# EAGLE schematic ArtNet SMD (EAGLE 5.11)
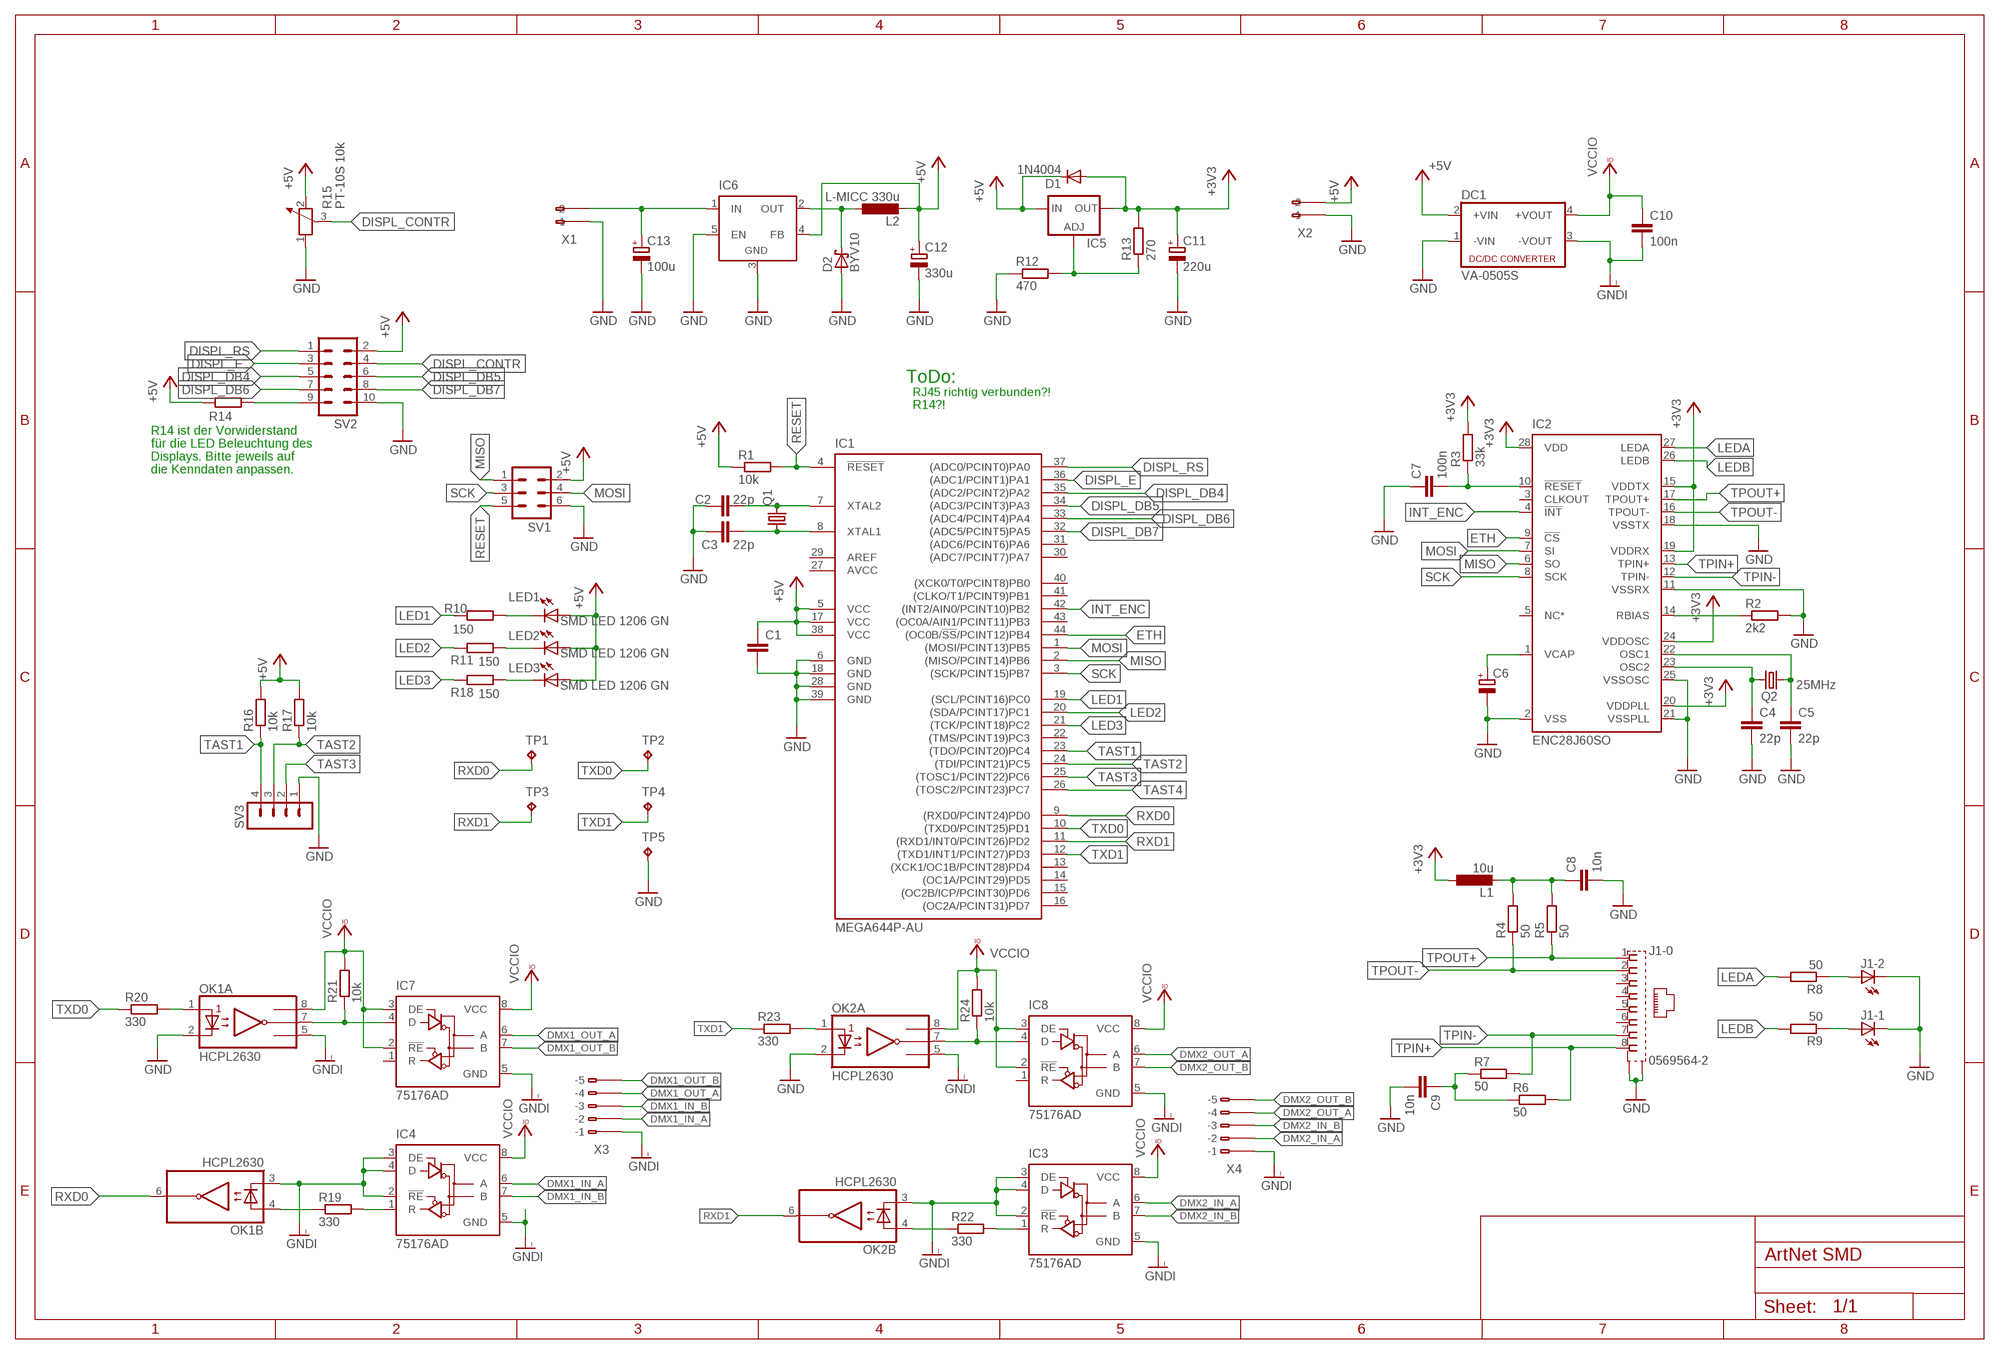
[diagram p0: schematic, sheet 1]

## Parts
C1  C-EUC1206  [C1206]
C2  22p  C-EUC1206  [C1206]
C3  22p  C-EUC1206  [C1206]
C4  22p  C-EUC1206  [C1206]
C5  22p  C-EUC1206  [C1206]
C6  CPOL-EUUD-4X5,8  [UD-4X5,8_NICHICON]
C7  100n  C-EUC1206  [C1206]
C8  10n  C-EUC1206  [C1206]
C9  10n  C-EUC1206  [C1206]
C10  100n  C-EUC1206  [C1206]
C11  220u  CPOL-EUUD-6,3X7,7  [UD-6,3X7,7_NICHICON]
C12  330u  CPOL-EUUD-6,3X7,7  [UD-6,3X7,7_NICHICON]
C13  100u  CPOL-EUUD-5X5,8  [UD-5X5,8_NICHICON]
D1  1N4004  [DO41-10]
D2  BYV10  [DO41-10]
DC1  VA-0505S  [4SIL]
IC1  MEGA644P-AU  MEGA164P/324P/644P-AU  [TQFP44]
IC2  ENC28J60SO  [SO28W]
IC3  75176AD  [D_R-PDSO-G8]
IC4  75176AD  [D_R-PDSO-G8]
IC5  LM317TS  [317TS]
IC6  LM2596TV  [TO220-51]
IC7  75176AD  [D_R-PDSO-G8]
IC8  75176AD  [D_R-PDSO-G8]
J1  0569564-2  [0569564]
L1  10u  L-EULAL02  [LAL02]
L2  L-MICC 330u  L-EU0207/5V  [0207/5V]
LED1  SMD LED 1206 GN  LEDCHIPLED_1206  [CHIPLED_1206]
LED2  SMD LED 1206 GN  LEDCHIPLED_1206  [CHIPLED_1206]
LED3  SMD LED 1206 GN  LEDCHIPLED_1206  [CHIPLED_1206]
OK1  HCPL2630  [DIL08]
OK2  HCPL2630  [DIL08]
Q1  CRYSTALSM49  [SM49]
Q2  25MHz  CRYSTALHC49U-V  [HC49U-V]
R1  10k  R-EU_R1206  [R1206]
R2  2k2  R-EU_R1206  [R1206]
R3  33k  R-EU_R1206  [R1206]
R4  50  R-EU_R1206  [R1206]
R5  50  R-EU_R1206  [R1206]
R6  50  R-EU_R1206  [R1206]
R7  50  R-EU_R1206  [R1206]
R8  50  R-EU_R1206  [R1206]
R9  50  R-EU_R1206  [R1206]
R10  150  R-EU_R1206  [R1206]
R11  150  R-EU_R1206  [R1206]
R12  470  R-EU_R1206  [R1206]
R13  270  R-EU_R1206  [R1206]
R14  R-EU_R1206  [R1206]
R15  PT-10S 10k  POTENTIOMETER_PT-10S  [PT-10S]
R16  10k  R-EU_R1206  [R1206]
R17  10k  R-EU_R1206  [R1206]
R18  150  R-EU_R1206  [R1206]
R19  330  R-EU_R1206  [R1206]
R20  330  R-EU_R1206  [R1206]
R21  10k  R-EU_R1206  [R1206]
R22  330  R-EU_R1206  [R1206]
R23  330  R-EU_R1206  [R1206]
R24  10k  R-EU_R1206  [R1206]
SV1  MA03-2  [MA03-2]
SV2  MA05-2  [MA05-2]
SV3  MA04-1  [MA04-1]
TP1  TPTP10R  [TP10R]
TP2  TPTP10R  [TP10R]
TP3  TPTP10R  [TP10R]
TP4  TPTP10R  [TP10R]
TP5  TPTP10R  [TP10R]
X1  233-502  [233-502]
X2  233-502  [233-502]
X3  233-505  [233-505]
X4  233-505  [233-505]

## Nets
+3V3: C11.+ D1.A IC2.15(VDDTX) IC2.19(VDDRX) IC2.20(VDDPLL) IC2.24(VDDOSC) IC2.28(VDD) IC5.2(OUT) L1.1 R3.2 R13.2
+5V: C1.1 C12.+ D1.C DC1.2(+VIN) IC1.5(VCC) IC1.17(VCC) IC1.38(VCC) IC5.3(IN) IC6.4(FB) L2.2 LED1.A LED2.A LED3.A R1.1 R14.1 R15.2 R16.2 R17.2 SV1.2 SV2.2 X2.A2(-2)
DISPL_CONTR: R15.3 SV2.4
DISPL_DB4: IC1.35((ADC2/PCINT2)PA2) SV2.5
DISPL_DB5: IC1.34((ADC3/PCINT3)PA3) SV2.6
DISPL_DB6: IC1.33((ADC4/PCINT4)PA4) SV2.7
DISPL_DB7: IC1.32((ADC5/PCINT5)PA5) SV2.8
DISPL_E: IC1.36((ADC1/PCINT1)PA1) SV2.3
DISPL_RS: IC1.37((ADC0/PCINT0)PA0) SV2.1
DMX1_IN_A: IC4.6(A) X3.B2(B-2)
DMX1_IN_B: IC4.7(B) X3.B3(B-3)
DMX1_OUT_A: IC7.6(A) X3.B4(B-4)
DMX1_OUT_B: IC7.7(B) X3.B5(B-5)
DMX2_IN_A: IC3.6(A) X4.B2(B-2)
DMX2_IN_B: IC3.7(B) X4.B3(B-3)
DMX2_OUT_A: IC8.6(A) X4.B4(B-4)
DMX2_OUT_B: IC8.7(B) X4.B5(B-5)
ETH: IC1.44((OC0B/!SS!/PCINT12)PB4) IC2.9(!CS)
GND: C1.2 C2.1 C3.1 C4.2 C5.2 C6.- C7.1 C8.2 C9.2 C11.- C12.- C13.- D2.A DC1.1(-VIN) IC1.6(GND) IC1.18(GND) IC1.28(GND) IC1.39(GND) IC2.2(VSS) IC2.11(VSSRX) IC2.18(VSSTX) IC2.21(VSSPLL) IC2.25(VSSOSC) IC6.3(GND) IC6.5(EN) J1.C1(-1:C) J1.C2(-2:C) J1.S1(-0:S1) J1.S2(-0:S2) OK1.2(A:C1) OK2.2(A:C1) R2.2 R12.1 R15.1 SV1.6 SV2.10 SV3.1 TP5.TP X1.A1(-1) X2.A1(-1)
GNDI: C10.2 DC1.3(-VOUT) IC3.2(!RE) IC3.3(DE) IC3.4(D) IC3.5(GND) IC4.2(!RE) IC4.3(DE) IC4.4(D) IC4.5(GND) IC7.5(GND) IC8.5(GND) OK1.3(B:C2) OK1.5(A:GND) OK2.3(B:C2) OK2.5(A:GND) X3.B1(B-1) X4.B1(B-1)
INT_ENC: IC1.42((INT2/AIN0/PCINT10)PB2) IC2.4(!INT)
LED1: IC1.19((SCL/PCINT16)PC0) R10.2
LED2: IC1.20((SDA/PCINT17)PC1) R11.2
LED3: IC1.21((TCK/PCINT18)PC2) R18.2
LEDA: IC2.27(LEDA) R8.2
LEDB: IC2.26(LEDB) R9.2
MISO: IC1.2((MISO/PCINT14)PB6) IC2.6(SO) SV1.1
MOSI: IC1.1((MOSI/PCINT13)PB5) IC2.7(SI) SV1.4
N$1: C3.2 IC1.8(XTAL1) Q1.1
N$2: C2.2 IC1.7(XTAL2) Q1.2
N$3: C7.2 IC2.10(!RESET) R3.1
N$4: C8.1 L1.2 R4.2 R5.2
N$5: R14.2 SV2.9
N$6: C9.1 R6.1 R7.1
N$7: J1.A2(-2:A) R8.1
N$8: J1.A1(-1:A) R9.1
N$9: LED1.C R10.1
N$10: C6.+ IC2.1(VCAP)
N$11: IC2.14(RBIAS) R2.1
N$12: LED3.C R18.1
N$13: C5.1 IC2.22(OSC1) Q2.1
N$14: C4.1 IC2.23(OSC2) Q2.2
N$15: LED2.C R11.1
N$17: IC5.1(ADJ) R12.2 R13.1
N$19: C13.+ IC6.1(IN) X1.A2(-2)
N$21: D2.C IC6.2(OUT) L2.1
N$23: OK1.4(B:A2) R19.1
N$26: OK2.1(A:A1) R23.2
N$27: OK2.4(B:A2) R22.1
N$28: IC4.1(R) R19.2
N$29: IC3.1(R) R22.2
N$30: IC8.4(D) OK2.7(A:VO1) R24.1
N$32: IC7.4(D) OK1.7(A:VO1) R21.1
N$33: OK1.1(A:A1) R20.2
RESET: IC1.4(!RESET) R1.2 SV1.5
RXD0: IC1.9((RXD0/PCINT24)PD0) OK1.6(B:VO2) TP1.TP
RXD1: IC1.11((RXD1/INT0/PCINT26)PD2) OK2.6(B:VO2) TP3.TP
SCK: IC1.3((SCK/PCINT15)PB7) IC2.8(SCK) SV1.3
TAST1: IC1.23((TDO/PCINT20)PC4) R16.1 SV3.4
TAST2: IC1.24((TDI/PCINT21)PC5) R17.1 SV3.3
TAST3: IC1.25((TOSC1/PCINT22)PC6) SV3.2
TAST4: IC1.26((TOSC2/PCINT23)PC7)
TPIN+: IC2.13(TPIN+) J1.8 R6.2
TPIN-: IC2.12(TPIN-) J1.7 R7.2
TPOUT+: IC2.17(TPOUT+) J1.1 R5.1
TPOUT-: IC2.16(TPOUT-) J1.2 R4.1
TXD0: IC1.10((TXD0/PCINT25)PD1) R20.1 TP2.TP
TXD1: IC1.12((TXD1/INT1/PCINT27)PD3) R23.1 TP4.TP
VCCIO: C10.1 DC1.4(+VOUT) IC3.8(VCC) IC4.8(VCC) IC7.2(!RE) IC7.3(DE) IC7.8(VCC) IC8.2(!RE) IC8.3(DE) IC8.8(VCC) OK1.8(A:VCC) OK2.8(A:VCC) R21.2 R24.2
Unconnected: IC1.13((XCK1/OC1B/PCINT28)PD4) IC1.14((OC1A/PCINT29)PD5) IC1.15((OC2B/ICP/PCINT30)PD6) IC1.16((OC2A/PCINT31)PD7) IC1.22((TMS/PCINT19)PC3) IC1.30((ADC7/PCINT7)PA7) IC1.31((ADC6/PCINT6)PA6) IC1.40((XCK0/T0/PCINT8)PB0) IC1.41((CLKO/T1/PCINT9)PB1) IC1.43((OC0A/AIN1/PCINT11)PB3) IC2.3(CLKOUT) IC2.5(NC*) IC7.1(R) IC8.1(R) J1.3 J1.4 J1.5 J1.6 X1.B1(B-1) X1.B2(B-2) X2.B1(B-1) X2.B2(B-2) X3.A1(-1) X3.A2(-2) X3.A3(-3) X3.A4(-4) X3.A5(-5) X4.A1(-1) X4.A2(-2) X4.A3(-3) X4.A4(-4) X4.A5(-5)

## Notes on the sheet
- ToDo:
- RJ45 richtig verbunden?!
- R14?!
- R14 ist der Vorwiderstand
- für die LED Beleuchtung des
- Displays. Bitte jeweils auf
- die Kenndaten anpassen.

## Power pins joined to a net without a drawn wire
AREF: IC1.29(AREF)
AVCC: IC1.27(AVCC)

## Library data of the parts
C1-C5 C7-C10 = rcl:C-EU: CAPACITOR, European symbol
C6 C11-C13 = rcl:CPOL-EU: POLARIZED CAPACITOR, European symbol
D1 = diode:1N4004: DIODE general purpose rectifier, 1 A
D2 = diode:BYV10: DIODE power diode
DC1 = dc-dc-converter:VA-*?: DC DC Converter Single Output, 1 Watt Motien Technology Co.,Ltd. Source: va-serie.pdf; OC_FARNELL: unknown; OC_NEWARK: unknown
IC1 = avr-7:MEGA164P/324P/644P-AU
IC2 = microchip-6:ENC28J60: Stand-Alone Ethernet Controller with SPI Interface Source: http://ww1.microchip.com/downloads/en/DeviceDoc/39662c.pdf
IC3 IC4 IC7 IC8 = 751xx:75176A: DIFFERENTIAL BUS TRANSCEIVER Source: http://focus.ti.com/lit/ds/symlink/sn75176a.pdf
IC5 = v-reg:LM317TS: VOLTAGE REGULATOR
IC6 = linear:LM2596T: STEP-DOWN VOLTAGE REGULATOR
J1 = con-amp:0569564-*: MODULAR JACK 8 POS., RIGHT ANGLE, LOW PROFILE WITH LEDS Source: http://ecommas.tycoelectronics.com/.. 569564_K.pdf; OC_FARNELL: unknown; OC_NEWARK: unknown
L1 L2 = rcl:L-EU: INDUCTOR, European symbol
LED1-LED3 = led:LED: LED OSRAM: - CHIPLED LG R971, LG N971, LY N971, LG Q971, LY Q971, LO R971, LY R971 LH N974, LH R974 LS Q976, LO Q976, LY Q976 LO Q996 - Hyper CHIPLED LW Q18S LB Q993, LB Q99A, LB R99A - SideLED LS A670, LO A670, LY A670, LG A670, LP A670 LB A673, LV A673, LT A673, LW A673 LH A674 LY A675 LS A676, LA A676, LO A676, LY A676, LW A676 LS A679, LY A679, LG A679 - Hyper Micro SIDELED® LS Y876, LA Y876, LO Y876, LY Y876 LT Y87S - SmartLED LW L88C, LW L88S LB L89C, LB L89S, LG L890 LS L89K, LO L89K, LY L89K LS L896, LA L896, LO L896, LY L896 - TOPLED LS T670, LO T670, LY T670, LG T670, LP T670 LSG T670, LSP T670, LSY T670, LOP T670, LYG T670 LG T671, LOG T671, LSG T671 LB T673, LV T673, LT T673, LW T673 LH T674 LS T676, LA T676, LO T676, LY T676, LB T676, LH T676, LSB T676, LW T676 LB T67C, LV T67C, LT T67C, LS T67K, LO T67K, LY T67K, LW E67C LS E67B, LA E67B, LO E67B, LY E67B, LB E67C, LV E67C, LT E67C LW T67C LS T679, LY T679, LG T679 LS T770, LO T770, LY T770, LG T770, LP T770 LB T773, LV T773, LT T773, LW T773 LH T774 LS E675, LA E675, LY E675, LS T675 LS T776, LA T776, LO T776, LY T776, LB T776 LHGB T686 LT T68C, LB T68C - Hyper Mini TOPLED® LB M676 - Mini TOPLED Santana® LG M470 LS M47K, LO M47K, LY M47K Source: http://www.osram.convergy.de LUXEON: - LUMILED® LXK2-PW12-R00, LXK2-PW12-S00, LXK2-PW14-U00, LXK2-PW14-V00 LXK2-PM12-R00, LXK2-PM12-S00, LXK2-PM14-U00 LXK2-PE12-Q00, LXK2-PE12-R00, LXK2-PE12-S00, LXK2-PE14-T00, LXK2-PE14-U00 LXK2-PB12-K00, LXK2-PB12-L00, LXK2-PB12-M00, LXK2-PB14-N00, LXK2-PB14-P00, LXK2-PB14-Q00 LXK2-PR12-L00, LXK2-PR12-M00, LXK2-PR14-Q00, LXK2-PR14-R00 LXK2-PD12-Q00, LXK2-PD12-R00, LXK2-PD12-S00 LXK2-PH12-R00, LXK2-PH12-S00 LXK2-PL12-P00, LXK2-PL12-Q00, LXK2-PL12-R00 Source: www.luxeon.com KINGBRIGHT: KA-3528ASYC Source: www.kingbright.com
OK1 OK2 = optocoupler:HCPL2630: HEWLETT PACKARD OPTO COUPLER; MF: AGILENT TECHNOLOGIES; MPN: HCPL-2630-000E; OC_FARNELL: 9994904; OC_NEWARK: 88H7813
Q1 = crystal:CRYSTAL: CRYSTAL; OC_FARNELL: unknown; OC_NEWARK: unknown
Q2 = crystal:CRYSTAL: CRYSTAL; OC_FARNELL: 1666969; OC_NEWARK: unknown
R1-R14 R16-R24 = rcl:R-EU_: RESISTOR, European symbol
R15 = rcl:POTENTIOMETER_: Potentiometer
SV1 = con-lstb:MA03-2: PIN HEADER; OC_FARNELL: unknown; OC_NEWARK: unknown
SV2 = con-lstb:MA05-2: PIN HEADER; OC_FARNELL: unknown; OC_NEWARK: unknown
SV3 = con-lstb:MA04-1: PIN HEADER; OC_FARNELL: unknown; OC_NEWARK: unknown
TP1-TP5 = testpad:TP: Test pad
X1 X2 = con-wago255:233-502: WAGO; MPN: 233-502; OC_FARNELL: 1777096; OC_NEWARK: 58M2630
X3 X4 = con-wago:233-505: WAGO Cage Clamp; MF: Wago Corporation; MPN: 0233-0505; OC_FARNELL: unknown; OC_NEWARK: 79K2051